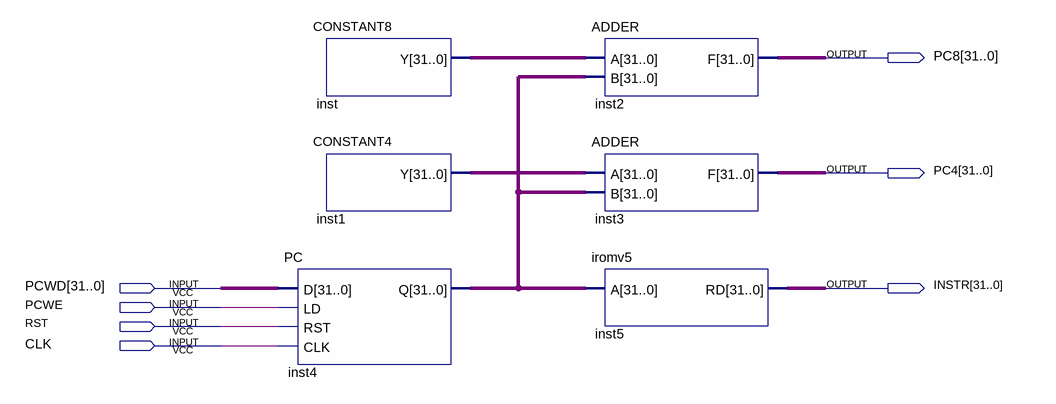
[diagram p0: schematic sheet]
// Quartus schematic fetch.bdf as structural Verilog: 6 symbols, 7 pins
module fetch (
  input  [31:0] PCWD,
  input  PCWE,
  input  RST,
  input  CLK,
  output [31:0] PC8,
  output [31:0] PC4,
  output [31:0] INSTR
);

  wire [31:0] inst1_y, inst4_q, inst_y;

  PC inst4 (.D(PCWD), .LD(PCWE), .RST(RST), .CLK(CLK), .Q(inst4_q));
  CONSTANT8 inst (.Y(inst_y));
  CONSTANT4 inst1 (.Y(inst1_y));
  ADDER inst2 (.A(inst_y), .B(inst4_q), .F(PC8));
  ADDER inst3 (.A(inst1_y), .B(inst4_q), .F(PC4));
  iromv5 inst5 (.A(inst4_q), .RD(INSTR));
endmodule
